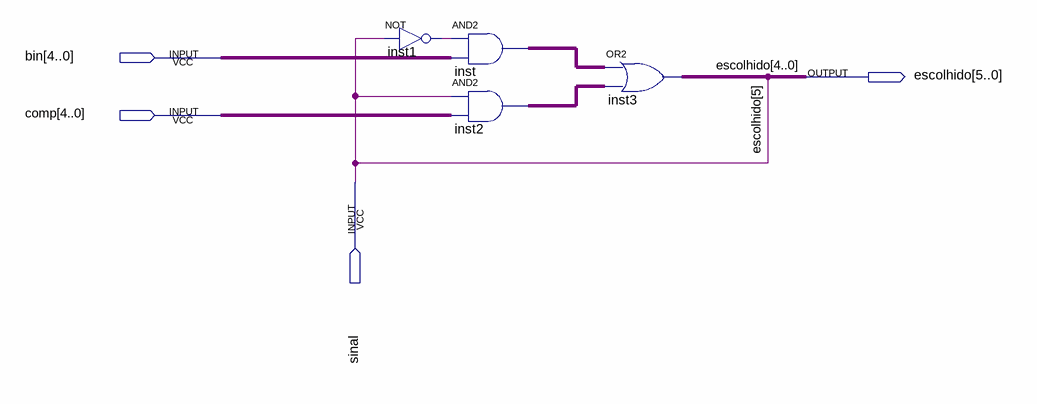
[diagram p0: schematic sheet]
// Quartus schematic MuxParaCompOuBin.bdf as structural Verilog: 4 symbols, 4 pins
module MuxParaCompOuBin (
  input  [4:0] bin,
  input  [4:0] comp,
  input  sinal,
  output [5:0] escolhido
);

  wire inst1_out;
  wire [4:0] inst2_out, inst_out;

  not inst1 (inst1_out, sinal);
  assign inst_out = {5{inst1_out}} & bin;  // AND2 inst, 5 bits wide
  assign inst2_out = {5{sinal}} & comp;  // AND2 inst2, 5 bits wide
  assign escolhido[4:0] = inst_out | inst2_out;  // OR2 inst3, 5 bits wide

  assign escolhido[5] = sinal;
endmodule
